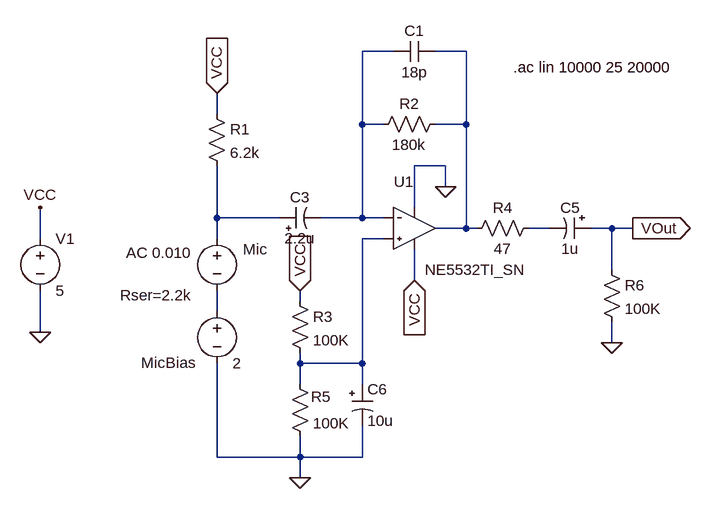
[diagram p0: schematic preamp_ne5532.asc]
preamp_ne5532.asc, the LTspice schematic file:
Version 4
SHEET 1 1572 760
WIRE 544 -112 496 -112
WIRE 656 -112 608 -112
WIRE 272 -16 272 -48
WIRE 496 0 496 -112
WIRE 528 0 496 0
WIRE 656 0 656 -112
WIRE 656 0 608 0
WIRE 624 64 576 64
WIRE 624 96 624 64
WIRE 576 128 576 64
WIRE 272 144 272 64
WIRE 368 144 272 144
WIRE 496 144 496 0
WIRE 496 144 432 144
WIRE 528 144 496 144
WIRE 656 160 656 0
WIRE 656 160 608 160
WIRE 672 160 656 160
WIRE 784 160 752 160
WIRE 880 160 848 160
WIRE 912 160 880 160
WIRE 0 176 0 128
WIRE 272 176 272 144
WIRE 528 176 496 176
WIRE 880 224 880 160
WIRE 576 240 576 192
WIRE 400 272 400 256
WIRE 272 288 272 256
WIRE 0 320 0 256
WIRE 880 336 880 304
WIRE 400 368 400 352
WIRE 496 368 496 176
WIRE 496 368 400 368
WIRE 400 400 400 368
WIRE 496 400 496 368
WIRE 272 512 272 368
WIRE 400 512 400 480
WIRE 400 512 272 512
WIRE 496 512 496 464
WIRE 496 512 400 512
WIRE 400 544 400 512
FLAG 400 544 0
FLAG 880 336 0
FLAG 0 128 VCC
FLAG 272 -48 VCC
IOPIN 272 -48 In
FLAG 400 256 VCC
IOPIN 400 256 In
FLAG 0 320 0
FLAG 624 96 0
FLAG 576 240 VCC
IOPIN 576 240 In
FLAG 912 160 VOut
IOPIN 912 160 Out
SYMBOL res 256 -32 R0
SYMATTR InstName R1
SYMATTR Value 6.2k
SYMATTR SpiceLine tol=1 pwr=0.1
SYMBOL res 384 256 R0
SYMATTR InstName R3
SYMATTR Value 100K
SYMATTR SpiceLine tol=1 pwr=0.1
SYMBOL res 384 384 R0
WINDOW 0 33 35 Left 2
SYMATTR InstName R5
SYMATTR Value 100K
SYMATTR SpiceLine tol=1 pwr=0.1
SYMBOL polcap 368 160 R270
WINDOW 0 32 32 VTop 2
WINDOW 3 0 32 VBottom 2
SYMATTR InstName C3
SYMATTR Value 2.2u
SYMATTR Description Capacitor
SYMATTR Type cap
SYMATTR SpiceLine V=16 Irms=35m Rser=2.8 Lser=0
SYMBOL polcap 480 400 R0
WINDOW 3 24 56 Left 2
SYMATTR Value 10u
SYMATTR InstName C6
SYMATTR Description Capacitor
SYMATTR Type cap
SYMATTR SpiceLine V=16 Irms=35m Rser=2.8 Lser=0
SYMBOL polcap 848 144 R90
WINDOW 0 0 32 VBottom 2
WINDOW 3 32 32 VTop 2
SYMATTR InstName C5
SYMATTR Value 1u
SYMATTR Description Capacitor
SYMATTR Type cap
SYMATTR SpiceLine V=50 Irms=12m Rser=22 Lser=0
SYMBOL res 624 -16 R90
WINDOW 0 0 56 VBottom 2
WINDOW 3 32 56 VTop 2
SYMATTR InstName R2
SYMATTR Value 180k
SYMATTR SpiceLine tol=1 pwr=0.1
SYMBOL res 768 144 R90
WINDOW 0 0 56 VBottom 2
WINDOW 3 32 56 VTop 2
SYMATTR InstName R4
SYMATTR Value 47
SYMATTR SpiceLine tol=1 pwr=0.1
SYMBOL res 864 208 R0
SYMATTR InstName R6
SYMATTR Value 100K
SYMATTR SpiceLine tol=1 pwr=0.1
SYMBOL voltage 0 160 R0
WINDOW 123 0 0 Left 0
WINDOW 39 0 0 Left 0
SYMATTR InstName V1
SYMATTR Value 5
SYMBOL voltage 272 160 R0
WINDOW 0 40 32 Left 2
WINDOW 3 24 44 Left 2
WINDOW 123 -140 38 Left 2
WINDOW 39 -149 103 Left 2
SYMATTR InstName Mic
SYMATTR Value ""
SYMATTR Value2 AC 0.010
SYMATTR SpiceLine Rser=2.2k
SYMBOL voltage 272 272 R0
WINDOW 0 -117 95 Left 2
WINDOW 123 0 0 Left 0
WINDOW 39 24 124 Left 2
SYMATTR InstName MicBias
SYMATTR Value 2
SYMBOL NE5532TI_SN 560 160 R0
WINDOW 3 110 48 Top 2
SYMATTR InstName U1
SYMBOL cap 608 -128 R90
WINDOW 0 0 32 VBottom 2
WINDOW 3 32 32 VTop 2
SYMATTR InstName C1
SYMATTR Value 18p
SYMATTR SpiceLine V=25 Irms=0 Rser=0 Lser=0
TEXT 728 -88 Left 2 !.ac lin 10000 25 20000

The netlist it stands for:
* preamp_ne5532.asc
R1 VCC N003 6.2k tol=1 pwr=0.1
R3 VCC N005 100K tol=1 pwr=0.1
R5 N005 0 100K tol=1 pwr=0.1
C3 N003 N001 2.2u V=16 Irms=35m Rser=2.8 Lser=0
C6 N005 0 10u V=16 Irms=35m Rser=2.8 Lser=0
C5 VOut N004 1u V=50 Irms=12m Rser=22 Lser=0
R2 N002 N001 180k tol=1 pwr=0.1
R4 N004 N002 47 tol=1 pwr=0.1
R6 VOut 0 100K tol=1 pwr=0.1
V1 VCC 0 5
V§Mic N003 N006 AC 0.010 Rser=2.2k
V§MicBias N006 0 2
XU1 N005 N001 VCC 0 N002 NE5532TI_SN  ; pins + - 3 4 Out
C1 N002 N001 18p V=25 Irms=0 Rser=0 Lser=0
.ac lin 10000 25 20000
.lib C:\Users\dark\Projects\electret_preamp\ltspice\NE5532_SN.lib
.backanno
.end